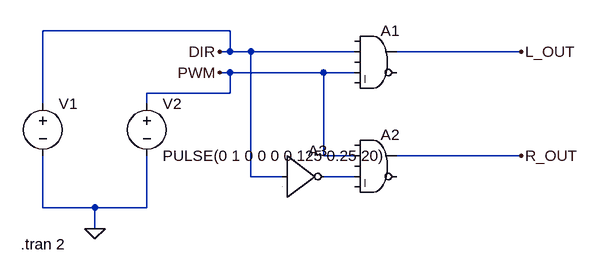
[diagram p0: schematic motor_driver_logic.asc]
motor_driver_logic.asc, the LTspice schematic file:
Version 4
SHEET 1 880 680
WIRE -48 48 -336 48
WIRE -48 80 -48 48
WIRE -48 80 -64 80
WIRE -16 80 -48 80
WIRE 144 80 -16 80
WIRE 400 80 208 80
WIRE -48 112 -64 112
WIRE 96 112 -48 112
WIRE 144 112 96 112
WIRE -48 144 -48 112
WIRE -48 144 -176 144
WIRE -336 160 -336 48
WIRE -176 160 -176 144
WIRE 96 240 96 112
WIRE 144 240 96 240
WIRE 400 240 208 240
WIRE -16 272 -16 80
WIRE 32 272 -16 272
WIRE 144 272 96 272
WIRE -336 320 -336 240
WIRE -256 320 -336 320
WIRE -176 320 -176 240
WIRE -176 320 -256 320
WIRE -256 352 -256 320
FLAG 400 80 L_OUT
FLAG 400 240 R_OUT
FLAG -64 80 DIR
FLAG -64 112 PWM
FLAG -256 352 0
SYMBOL Digital\\and 176 32 R0
SYMATTR InstName A1
SYMBOL Digital\\and 176 192 R0
SYMATTR InstName A2
SYMBOL Digital\\inv 32 208 R0
SYMATTR InstName A3
SYMBOL voltage -336 144 R0
WINDOW 3 24 96 Invisible 2
WINDOW 123 0 0 Left 0
WINDOW 39 0 0 Left 0
SYMATTR InstName V1
SYMATTR Value PULSE(0 1 0 0 0 0.5 1 20)
SYMBOL voltage -176 144 R0
WINDOW 123 0 0 Left 0
WINDOW 39 0 0 Left 0
SYMATTR InstName V2
SYMATTR Value PULSE(0 1 0 0 0 0.125 0.25 20)
TEXT -370 376 Left 2 !.tran 2

The netlist it stands for:
* motor_driver_logic.asc
A1 0 DIR 0 PWM 0 0 L_OUT 0 AND
A2 0 PWM 0 N001 0 0 R_OUT 0 AND
A3 DIR 0 0 0 0 N001 0 0 BUF
V1 DIR 0 PULSE(0 1 0 0 0 0.5 1 20)
V2 PWM 0 PULSE(0 1 0 0 0 0.125 0.25 20)
.tran 2
.backanno
.end